# Altium schematic sheet TempSensor.SchDoc
size A4; SheetNumber: 3; SheetTotal: 8
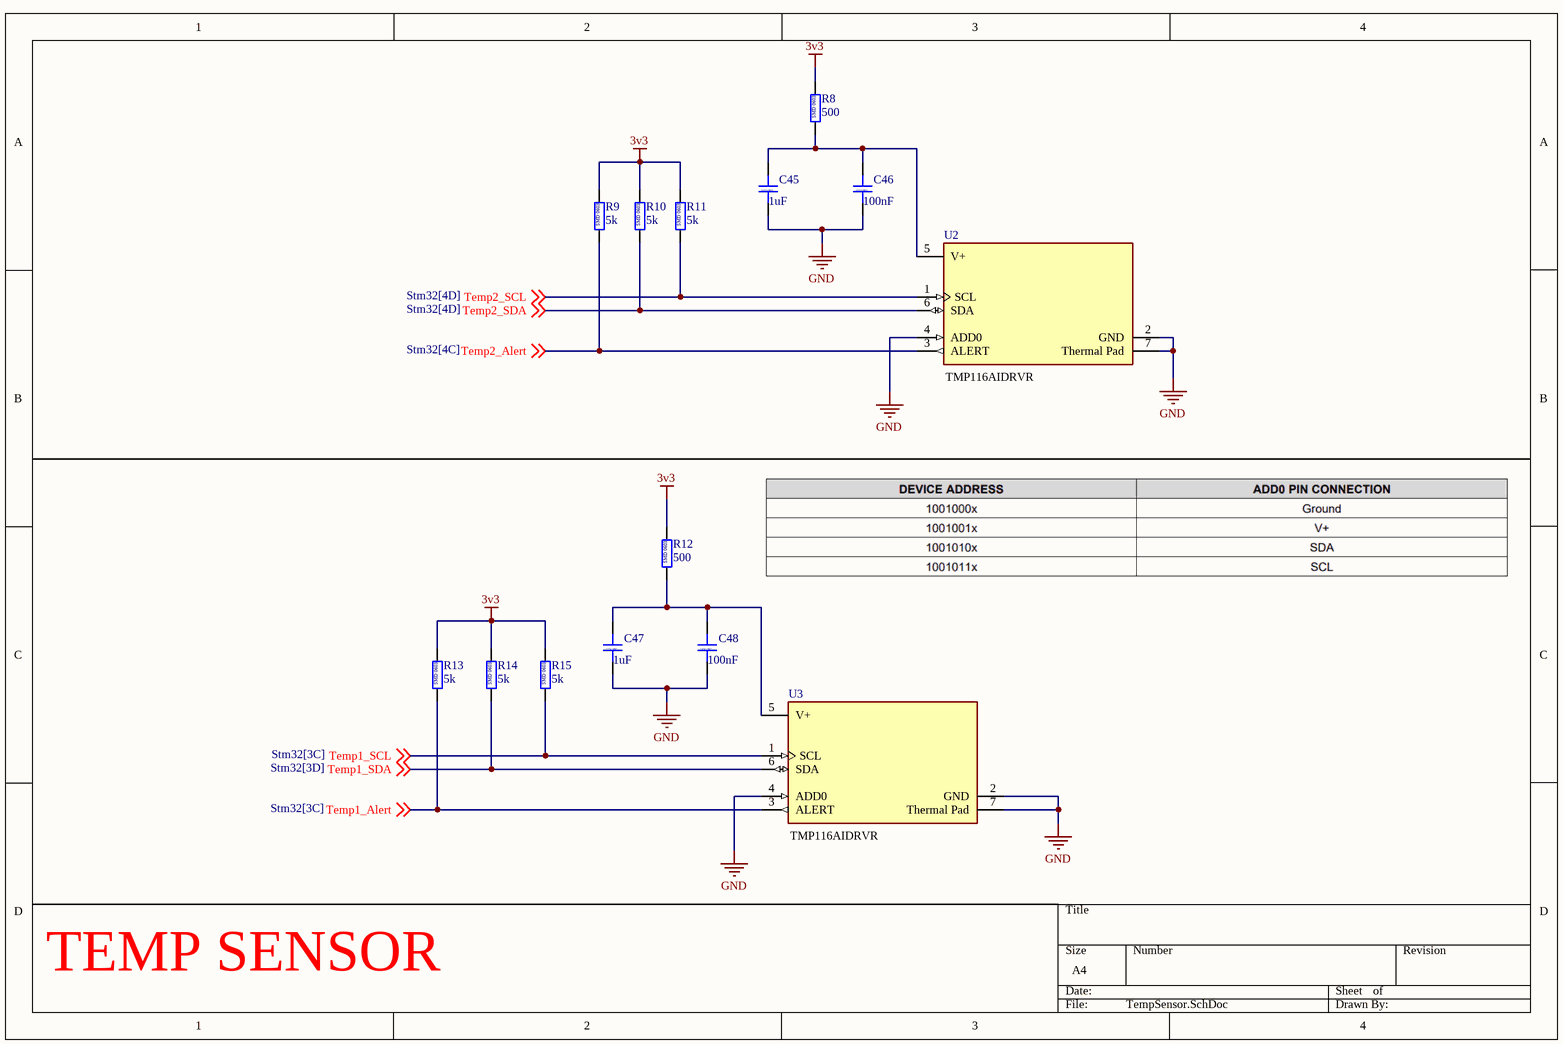
[diagram p0: TempSensor.SchDoc]

## Parts
C45  1uF  [CAP_0603]
C46  100nF  [CAP_0603]
C47  1uF  [CAP_0603]
C48  100nF  [CAP_0603]
R8  500  [RES_0603]
R9  5k  [RES_0603]
R10  5k  [RES_0603]
R11  5k  [RES_0603]
R12  500  [RES_0603]
R13  5k  [RES_0603]
R14  5k  [RES_0603]
R15  5k  [RES_0603]
U2  (no value)  [FP-DRV0006A-IPC_C]
U3  (no value)  [FP-DRV0006A-IPC_C]

## Nets
3v3: R8.2 R9.2 R10.2 R11.2 R12.2 R13.2 R14.2 R15.2
GND: C45.1 C46.1 C47.1 C48.1 U2.2(GND) U2.4(ADD0) U2.7(Thermal_Pad) U3.2(GND) U3.4(ADD0) U3.7(Thermal_Pad)
Temp1_Alert: R13.1 U3.3(ALERT) ; off-sheet Temp1_Alert
Temp1_SCL: R15.1 U3.1(SCL) ; off-sheet Temp1_SCL
Temp1_SDA: R14.1 U3.6(SDA) ; off-sheet Temp1_SDA
Temp2_Alert: R9.1 U2.3(ALERT) ; off-sheet Temp2_Alert
Temp2_SCL: R11.1 U2.1(SCL) ; off-sheet Temp2_SCL
Temp2_SDA: R10.1 U2.6(SDA) ; off-sheet Temp2_SDA
NetC45_2: C45.2 C46.2 R8.1 U2.5(V+)
NetC47_2: C47.2 C48.2 R12.1 U3.5(V+)

## Notes on the sheet
- (near U2) TMP116AIDRVR
- (near U3) TMP116AIDRVR
- TEMP SENSOR
- (in symbol Capacitor-SMD-0603) SMD 0603
- (in symbol Resistor-SMD-0603) SMD 0603

## Library data of the parts
C45-C48 = Capacitor-SMD-0603: Capacitor SMD 0603 RATED
R8-R15 = Resistor-SMD-0603: Resistor SMD 0603 RATED
U2 U3 = CMP-04948-000045-1: SENSOR DIGITAL -55C-125C 6WSON; Resolution: 16b; Output Type: I2C; Mount: Surface Mount; Max Operating Temperature: 150°C; Interface: I2C; RoHS Compliant: Yes; Packaging: Tape and Reel; Min Operating Temperature: -55°C